# Altium schematic sheet Sheet2.SchDoc
size A4; SheetNumber: 2; SheetTotal: 2
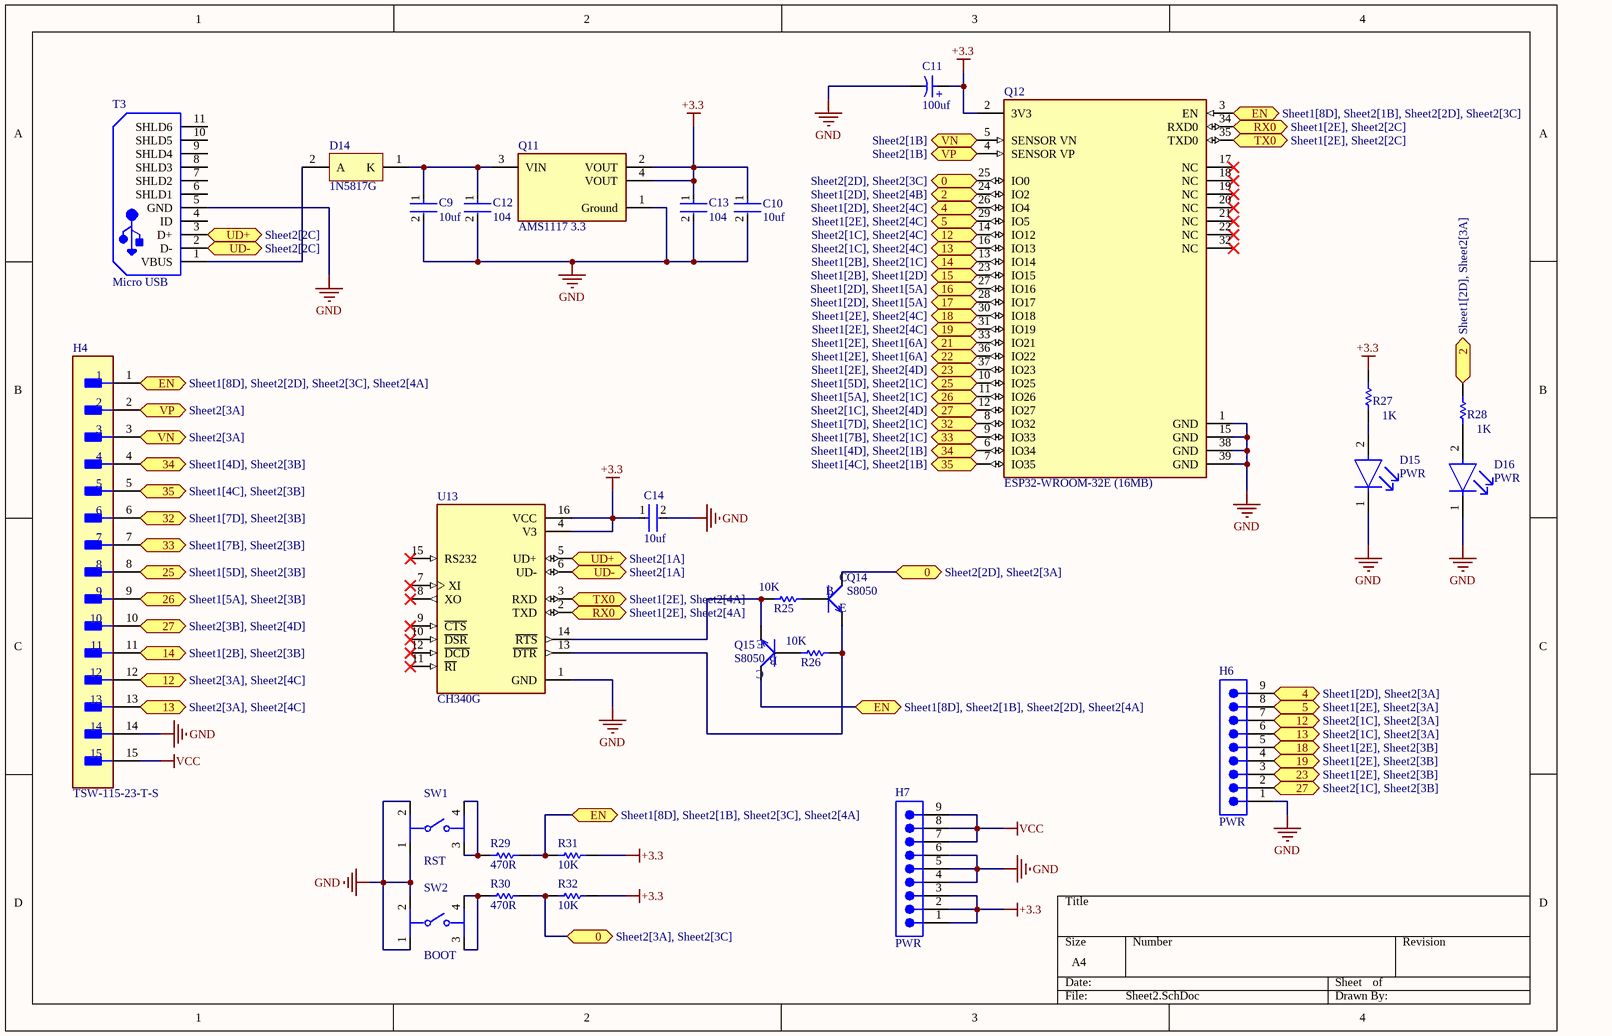
[diagram p0: Sheet2.SchDoc]

## Parts
C9  10uf  [FP-GRM21B-0_1-MFG]
C10  10uf  [FP-GRM21B-0_1-MFG]
C11  100uf  [WCAP-PT5H_D6.3H11]
C12  104  [FP-GRM21B-0_1-MFG]
C13  104  [FP-GRM21B-0_1-MFG]
C14  10uf  [FP-GRM21B-0_1-MFG]
D14  1N5817G  [ONSC-AXIAL_LEAD-2-59-10_P]
D15  PWR  [FP-KP-2012QBC-D-MFG]
D16  PWR  [FP-KP-2012QBC-D-MFG]
H4  TSW-115-23-T-S  [FP-TSW-115-23-T-S-MFG]
H6  PWR  [61300911121]
H7  PWR  [61300911121]
Q11  AMS1117 3.3  [FP-AMS1117-IPC_A]
Q12  ESP32-WROOM-32E (16MB)  [FP-ESP32-WROOM-32E_16MB-MFG]
Q14  S8050  [SOT-23]
Q15  S8050  [SOT-23]
R25  10K  [RESC2013X70X40NL20T20]
R26  10K  [RESC2013X70X40NL20T20]
R27  1K  [RESC2013X70X40NL20T20]
R28  1K  [RESC2013X70X40NL20T20]
R29  470R  [RESC2013X70X40NL20T20]
R30  470R  [RESC2013X70X40NL20T20]
R31  10K  [RESC2013X70X40NL20T20]
R32  10K  [RESC2013X70X40NL20T20]
SW1  RST  [FP-TL1105AF160Q-MFG]
SW2  BOOT  [FP-TL1105AF160Q-MFG]
T3  Micro USB  [FCI-10118193-0001LF-5_V]
U13  CH340G  [SOIC127P600X180-16N]

## Ports
0 (bidir, see Sheet2[2D], Sheet2[3A]), 0 (bidir, see Sheet2[2D], Sheet2[3C]), 0 (bidir, see Sheet2[3A], Sheet2[3C]), 2 (bidir, see Sheet1[2D], Sheet2[3A]), 2 (bidir, see Sheet1[2D], Sheet2[4B]), 4 (bidir, see Sheet1[2D], Sheet2[3A]), 4 (bidir, see Sheet1[2D], Sheet2[4C]), 5 (bidir, see Sheet1[2E], Sheet2[3A]), 5 (bidir, see Sheet1[2E], Sheet2[4C]), 12 (bidir, see Sheet2[1C], Sheet2[3A]), 12 (bidir, see Sheet2[1C], Sheet2[4C]), 12 (bidir, see Sheet2[3A], Sheet2[4C]), 13 (bidir, see Sheet2[1C], Sheet2[3A]), 13 (bidir, see Sheet2[1C], Sheet2[4C]), 13 (bidir, see Sheet2[3A], Sheet2[4C]), 14 (bidir, see Sheet1[2B], Sheet2[1C]), 14 (bidir, see Sheet1[2B], Sheet2[3B]), 15 (bidir, see Sheet1[2B], Sheet1[2D]), 16 (bidir, see Sheet1[2D], Sheet1[5A]), 17 (bidir, see Sheet1[2D], Sheet1[5A]), 18 (bidir, see Sheet1[2E], Sheet2[3B]), 18 (bidir, see Sheet1[2E], Sheet2[4C]), 19 (bidir, see Sheet1[2E], Sheet2[3B]), 19 (bidir, see Sheet1[2E], Sheet2[4C]), 21 (bidir, see Sheet1[2E], Sheet1[6A]), 22 (bidir, see Sheet1[2E], Sheet1[6A]), 23 (bidir, see Sheet1[2E], Sheet2[3B]), 23 (bidir, see Sheet1[2E], Sheet2[4D]), 25 (bidir, see Sheet1[5D], Sheet2[1C]), 25 (bidir, see Sheet1[5D], Sheet2[3B]), 26 (bidir, see Sheet1[5A], Sheet2[1C]), 26 (bidir, see Sheet1[5A], Sheet2[3B]), 27 (bidir, see Sheet2[1C], Sheet2[3B]), 27 (bidir, see Sheet2[1C], Sheet2[4D]), 27 (bidir, see Sheet2[3B], Sheet2[4D]), 32 (bidir, see Sheet1[7D], Sheet2[1C]), 32 (bidir, see Sheet1[7D], Sheet2[3B]), 33 (bidir, see Sheet1[7B], Sheet2[1C]), 33 (bidir, see Sheet1[7B], Sheet2[3B]), 34 (bidir, see Sheet1[4D], Sheet2[1B]), 34 (bidir, see Sheet1[4D], Sheet2[3B]), 35 (bidir, see Sheet1[4C], Sheet2[1B]), 35 (bidir, see Sheet1[4C], Sheet2[3B]), EN (bidir, see Sheet1[8D], Sheet2[1B], Sheet2[2D], Sheet2[3C]), EN (bidir, see Sheet1[8D], Sheet2[1B], Sheet2[2D], Sheet2[4A]), EN (bidir, see Sheet1[8D], Sheet2[1B], Sheet2[3C], Sheet2[4A]), EN (bidir, see Sheet1[8D], Sheet2[2D], Sheet2[3C], Sheet2[4A]), RX0 (bidir, see Sheet1[2E], Sheet2[2C]), RX0 (bidir, see Sheet1[2E], Sheet2[4A]), TX0 (bidir, see Sheet1[2E], Sheet2[2C]), TX0 (bidir, see Sheet1[2E], Sheet2[4A]), UD+ (bidir, see Sheet2[1A]), UD+ (bidir, see Sheet2[2C]), UD- (bidir, see Sheet2[1A]), UD- (bidir, see Sheet2[2C]), VN (bidir, see Sheet2[1B]), VN (bidir, see Sheet2[3A]), VP (bidir, see Sheet2[1B]), VP (bidir, see Sheet2[3A])

## Nets
+3.3: C10.1 C11.1(P) C13.1 C14.1 H7.1 H7.2 H7.3 Q11.2(VOUT) Q11.4(VOUT) Q12.2(3V3) R27.2 R31.1 R32.1 U13.4(V3) U13.16(VCC)
GND: C9.2 C10.2 C11.2(N) C12.2 C13.2 C14.2 D15.1(C) D16.1(C) H4.14 H6.1 H7.4 H7.5 H7.6 Q11.1(Ground) Q12.1(GND) Q12.15(GND) Q12.38(GND) Q12.39(GND) SW1.1 SW1.2 SW2.1 SW2.2 T3.5(GND) U13.1(GND)
VCC: H4.15 H7.7 H7.8 H7.9
0: Q12.25(IO0) Q14.3(C) R30.1 R32.2 ; port 0
2: Q12.24(IO2) R28.2 ; port 2
4: H6.9 Q12.26(IO4) ; port 4
5: H6.8 Q12.29(IO5) ; port 5
12: H4.12 H6.7 Q12.14(IO12) ; port 12
13: H4.13 H6.6 Q12.16(IO13) ; port 13
14: H4.11 Q12.13(IO14) ; port 14
15: Q12.23(IO15) ; port 15
16: Q12.27(IO16) ; port 16
17: Q12.28(IO17) ; port 17
18: H6.5 Q12.30(IO18) ; port 18
19: H6.4 Q12.31(IO19) ; port 19
21: Q12.33(IO21) ; port 21
22: Q12.36(IO22) ; port 22
23: H6.3 Q12.37(IO23) ; port 23
25: H4.8 Q12.10(IO25) ; port 25
26: H4.9 Q12.11(IO26) ; port 26
27: H4.10 H6.2 Q12.12(IO27) ; port 27
32: H4.6 Q12.8(IO32) ; port 32
33: H4.7 Q12.9(IO33) ; port 33
34: H4.4 Q12.6(IO34) ; port 34
35: H4.5 Q12.7(IO35) ; port 35
EN: H4.1 Q12.3(EN) Q15.3(C) R29.1 R31.2 ; port EN
RX0: Q12.34(RXD0) U13.2(TXD) ; port RX0
TX0: Q12.35(TXD0) U13.3(RXD) ; port TX0
UD+: T3.3(D+) U13.5(UD+) ; port UD+
UD-: T3.2(D-) U13.6(UD-) ; port UD-
VN: H4.3 Q12.5(SENSOR_VN) ; port VN
VP: H4.2 Q12.4(SENSOR_VP) ; port VP
NetC9_1: C9.1 C12.1 D14.1(K) Q11.3(VIN)
NetD14_2: D14.2(A) T3.1(VBUS)
NetD15_2: D15.2(A) R27.1
NetD16_2: D16.2(A) R28.1
NetQ14_1: Q14.1(B) R25.1
NetQ14_2: Q14.2(E) R26.1 U13.13(~{DTR})
NetQ15_1: Q15.1(B) R26.2
NetQ15_2: Q15.2(E) R25.2 U13.14(~{RTS})
NetR29_2: R29.2 SW1.3 SW1.4
NetR30_2: R30.2 SW2.3 SW2.4

Not connected (* = marked no-connect by the designer): Q12 17(NC)* 18(NC)* 19(NC)* 20(NC)* 21(NC)* 22(NC)* 32(NC)*; T3 4(ID) 6(SHLD1) 7(SHLD2) 8(SHLD3) 9(SHLD4) 10(SHLD5) 11(SHLD6); U13 7(XI)* 8(XO)* 9(~{CTS})* 10(~{DSR})* 11(~{RI})* 12(~{DCD})* 15(RS232)*

## Notes on the sheet
- (in symbol CMP-03913-54202640-1) +

## Library data of the parts
C9 C10 C12-C14 = CMP-2007-03453-2: Chip Multilayer Ceramic Capacitors for General Purpose, 0805, 10uF, X5R, 15%, 10%, 16V; Radiation Hardening: No; Thickness: 0.053inch; Voltage Rating (DC): 16V; Lead Free: Lead Free; Package Quantity: 1; Width: 1.25mm; Case Code (Imperial): 0805; Depth: 1.25mm; Packaging: Tape and Reel; Dielectric: X5R; Max Operating Temperature: 85°C; Tolerance: 10%; Voltage Rating: 16V; Voltage: 16V; Capacitance: 10uF; Height: 1.25mm; Case Code (Metric): 2012; Material: Ceramic; Mount: Surface Mount; Case/Package: 0805; REACH SVHC: No SVHC; Length: 2mm; Min Operating Temperature: -55°C; Termination: SMD/SMT
C11 = CMP-03913-54202640-1: 870235373001 WCAP-PT5H Aluminum Polymer Capacitors; Ripple Current: 4.8A; Voltage Rating (DC): 16V; Pitch: 2.5mm; ESR (Equivalent Series Resistance): 12mΩ; Leakage Current: 160µA; Life (Hours): 5000hours; Capacitance: 100µF; REACH SVHC: Unknown; Length: 11mm; Diameter: 6.3mm; Max Operating Temperature: 105°C; RoHS: Compliant; Case/Package: Radial; Voltage Rating: 16V; Min Operating Temperature: -55°C; NexarPartId: 54202640
D14 = CMP-1055-00035-1: Rectifier, 2-Pin Axial_Lead, Pb-Free, Bulk Bag; Manufacturer: On Semiconductor; Configuration: Single; IFSM Max (A): 25; ComponentLink3Description: Package Specification; ComponentLink3URL: http://www.onsemi.cn/pub_link/Collateral/59-10.PDF; ComponentLink2Description: Datasheet; PartNumber: 1N5817G; Packing: Bulk Bag; RoHS: TRUE; ComponentLink2URL: http://www.onsemi.cn/pub_link/Collateral/1N5817-D.PDF; PackageVersion: Rev. U, 02/2005; ComponentLink1Description: Manufacturer URL; PackageReference: AXIAL_LEAD-2-59-10; ComponentLink1URL: http://www.onsemi.com/; DatasheetVersion: Rev. 10; PackageDescription: 2-Pin, Axial Lead, Diameter 2.35 mm; Mounting Technology: Through Hole
D15 D16 = CMP-44529-000058-1: LED, Low Power, Blue, SMD, 0805 [2012 Metric], 20 mA, 3.3 V, 465 nm; Wavelength: 465nm; Lens Color: Clear; Number of LEDs: 1; Viewing Angle: 120°; Luminous Intensity: 100mcd; Dominant Wavelength: 470nm; Forward Voltage: 3.3V; Lens Style: Diffused; Forward Current: 20mA; Color: Blue; Packaging: Tape and Reel; Width: 2mm; Number of Pins: 2; Radiation Hardening: No; Series: KP; Length: 1.25mm; REACH SVHC: No SVHC; Case/Package: 2012; Mount: Surface Mount; Height: 1.1mm; RoHS Compliant: Yes
H4 = CMP-02766-001466-1: CONN HEADER VERT 15POS 2.54MM; Connector Type: Male Pin; Number of Contacts: 15; Gender: Male; Pitch: 0.1inch; Termination: Solder; Packaging: Bulk; Lead Free: Lead Free; Housing Color: Black; Housing Material: Plastic; Color: Black; RoHS Compliant: Yes; Contact Type: Male Pin; Width: 2.54mm; Mount: Through Hole; Contact Material: Bronze; Number of Rows: 1; Radiation Hardening: No; Number of Positions: 15; Length: 38.1mm; REACH SVHC: No SVHC; Height: 2.54mm; Contact Plating: Tin; Series: TSW; Contact Mating Length: 0.23inch
H6 H7 = CMP-1502-01080-3: NexarPartId: 32855536; Current Rating: 3A; Connector Type: Male Pin; Operating Supply Voltage: 250V; Contact Resistance: 20mΩ; Pitch: 2.54mm; Number of Contacts: 9; Gender: Male; Lead Pitch: 2.54mm; REACH SVHC: Unknown; Number of Rows: 1; Mount: Through Hole; Contact Plating: Gold; Color: Black; Number of Pins: 9; Orientation: Vertical; Contact Material: Copper; Packaging: Bulk; Contact Mating Length: 5.9944mm; RoHS: Compliant; Number of Positions: 9; Termination: Solder
Q11 = CMP-209535-000001-1: LDO Voltage Regulators 1A, 3.3V; Manufacturer Part Number: AMS1117-3.3; Manufacturer: Advanced Monolithic Systems; Dropout Voltage: 1.1V; Output Type: Fixed; Nominal Supply Current: 5mA; Max Power Dissipation: 1.2W; Max Supply Voltage: 15V; Number Of Outputs: 1; Standoff Height: 0.64mm; Max Junction Temp: +125°C; Height: 1.8mm; Package: AMS1117; Device Class L2: Power Management ICs; ComponentLink2Description: Datasheet; ComponentLink2URL: http://www.advanced-monolithic.com/pdf/ds1117.pdf; Category: IC; RoHS: TRUE; Automotive: No; Device Class L1: Integrated Circuits (ICs); Output Current: 1A; Device Class L3: Voltage Regulators - Linear; Temperature: -40°C to +125°C; Output Voltage: 3.3V; Temperature Range Low: -40°C; Octopart: https://octopart.com/ams1117-3.3-advanced+monolithic+systems-25899300; Lead Free: Yes; Ipc Land Pattern Name: SOT229P700X180-4; Temperature Range High: +125°C
Q12 = CMP-194065-000027-1: RX TXRX MOD WIFI TRACE ANT SMD
Q14 Q15 = SMD-TRANSISTORS-NPN-25V-500MW(SOT-23): Bipolar (BJT) Transistor NPN 25 V 500 mA 150MHz 300 mW Surface Mount SOT-23; MF: UMW; Purchase-URL: https://pricing.snapeda.com/search/part/S8050/?ref=eda; Check_prices: https://www.snapeda.com/parts/S8050/Umwelt+Sensor+Teknik/view-part/?ref=eda; SnapEDA_Link: https://www.snapeda.com/parts/S8050/Umwelt+Sensor+Teknik/view-part/?ref=snap; Price: None; Availability: In Stock; Package: None; MP: S8050; Value: *
R25-R32 = CMP-2001-04376-1: Manufacturer: Panasonic; Part Number: ERJ-6ENF1002V
SW1 SW2 = CMP-17879-000016-1: SWITCH TACTILE SPST-NO 0.05A 12V; Mechanical Life: 100000Cycles; Contact Current Rating: 50mA; Contact Resistance: 100mR; Switch Function: Off-Mom; Actuator Type: Standard; Actuator Length: 1.4mm; Max Voltage Rating (DC): 50V; Throw Configuration: SPST; Actuator Material: Nylon; Illumination Type: Non-Illuminated; Switch Travel: 0.25mm; Operating Force: 160gf; Package Quantity: 750; Width: 6mm; Series: TL1105; Voltage Rating (DC): 12V; Length: 6mm; Contact Plating: Silver; Color: Black; Housing Material: Nylon; Min Operating Temperature: -20°C; Lead Free: Lead Free; Mount: Through Hole; Termination: PC Pin; RoHS Compliant: Yes; Orientation: Straight; Max Operating Temperature: 70°C; Reach SVHC Compliant: Yes; Packaging: Bulk; Electrical Life: 100000Cycles; Current Rating: 50mA; Contact Material: Bronze; Size: 6mm
T3 = CMP-2000-05119-1: Micro USB B Type Receptacle, -55 to 85 degC, 5-Pin SMD, RoHS, Tape and Reel; Manufacturer: FCI; Insulation Resistance: 1000MOhms; Gender: Female; Current Rating: 1.8A; Number of Contacts: 5Contact; Connector Type: MicroUSBTypeBreceptacle; Color: Black; Mounting Angle: Right; Datasheet Version: Rev. C, 05/2015; Packaging: Reel; Product Category: USBConnectors; Standard: USB2.0; Factory Pack Quantity: 1200; Operating Temperature Range: -55Cto+85C; Termination Style: SMD/SMT; Datasheet URL: http://datasheet.octopart.com/10118193-0001LF-FCI-datasheet-55953155.pdf; Contact Material: CopperAlloy; RoHS: Details; Contact Plating: Gold; Flammability Rating: UL94V-0; Manufacturer URL: http://www.fci.com/; Brand: FCI; Product: MicroUSBTypeBConnectors
U13 = CH340G: USB Interface Integrated Circuit; MF: WCH; Value: *; SnapEDA_Link: https://www.snapeda.com/parts/Ch340G/WCH/view-part/?ref=snap; MP: Ch340G; Check_prices: https://www.snapeda.com/parts/Ch340G/WCH/view-part/?ref=eda; Availability: Not in stock; Price: None; Package: None